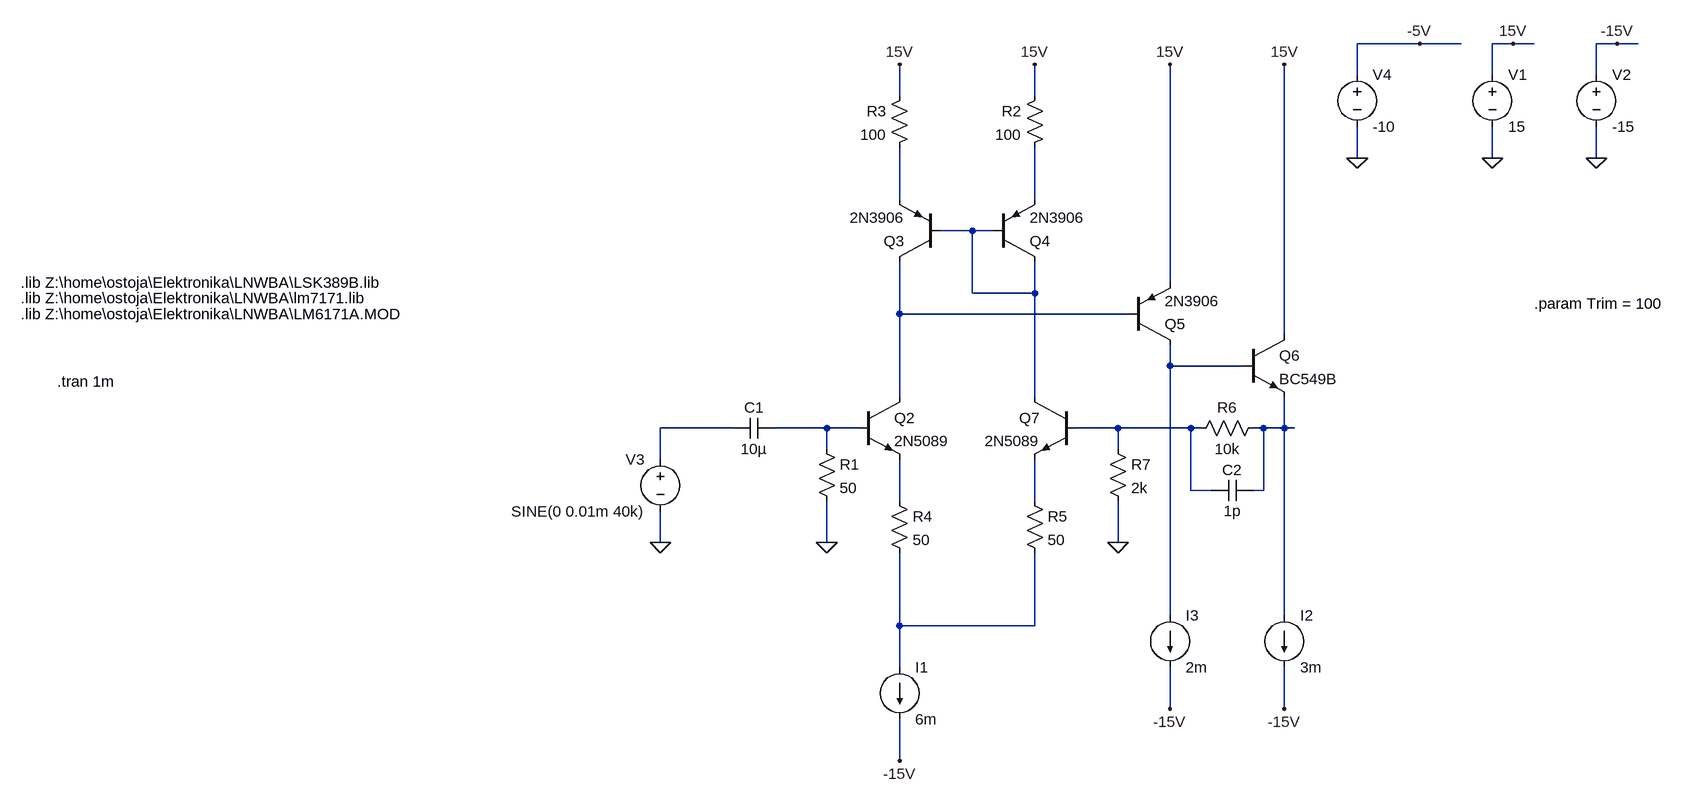
[diagram p0: schematic LNWBA_diy_opamp.asc]
LNWBA_diy_opamp.asc, the LTspice schematic file:
Version 4
SHEET 1 2516 820
WIRE 960 -592 864 -592
WIRE 1024 -592 960 -592
WIRE 1104 -592 1072 -592
WIRE 1136 -592 1104 -592
WIRE 1264 -592 1232 -592
WIRE 1296 -592 1264 -592
WIRE 864 -544 864 -592
WIRE 1072 -544 1072 -592
WIRE 1232 -544 1232 -592
WIRE 160 -512 160 -560
WIRE 368 -512 368 -560
WIRE 864 -416 864 -464
WIRE 1072 -416 1072 -464
WIRE 1232 -416 1232 -464
WIRE 160 -352 160 -432
WIRE 368 -352 368 -432
WIRE 272 -304 224 -304
WIRE 304 -304 272 -304
WIRE 576 -224 576 -560
WIRE 272 -208 272 -304
WIRE 368 -208 368 -256
WIRE 368 -208 272 -208
WIRE 160 -176 160 -256
WIRE 512 -176 160 -176
WIRE 752 -144 752 -560
WIRE 576 -96 576 -128
WIRE 688 -96 576 -96
WIRE 160 -48 160 -176
WIRE 368 -48 368 -208
WIRE -96 0 -208 0
WIRE 48 0 -32 0
WIRE 96 0 48 0
WIRE 496 0 432 0
WIRE 608 0 496 0
WIRE 624 0 608 0
WIRE 720 0 704 0
WIRE 752 0 752 -48
WIRE 752 0 720 0
WIRE 768 0 752 0
WIRE 48 32 48 0
WIRE 496 32 496 0
WIRE -208 48 -208 0
WIRE 608 96 608 0
WIRE 640 96 608 96
WIRE 720 96 720 0
WIRE 720 96 704 96
WIRE 160 112 160 48
WIRE 368 112 368 48
WIRE -208 176 -208 128
WIRE 48 176 48 112
WIRE 496 176 496 112
WIRE 576 288 576 -96
WIRE 752 288 752 0
WIRE 160 304 160 192
WIRE 368 304 368 192
WIRE 368 304 160 304
WIRE 160 368 160 304
WIRE 576 432 576 368
WIRE 752 432 752 368
WIRE 160 512 160 448
FLAG 1104 -592 15V
FLAG 1264 -592 -15V
FLAG 1232 -416 0
FLAG 1072 -416 0
FLAG 368 -560 15V
FLAG 160 512 -15V
FLAG -208 176 0
FLAG 960 -592 -5V
FLAG 864 -416 0
FLAG 48 176 0
FLAG 160 -560 15V
FLAG 576 -560 15V
FLAG 752 432 -15V
FLAG 576 432 -15V
FLAG 752 -560 15V
FLAG 496 176 0
SYMBOL voltage 1072 -560 R0
WINDOW 123 0 0 Left 0
WINDOW 39 0 0 Left 0
SYMATTR InstName V1
SYMATTR Value 15
SYMBOL voltage 1232 -560 R0
WINDOW 123 0 0 Left 0
WINDOW 39 0 0 Left 0
SYMATTR InstName V2
SYMATTR Value -15
SYMBOL voltage -208 32 M0
WINDOW 123 0 0 Left 0
WINDOW 39 0 0 Left 0
SYMATTR InstName V3
SYMATTR Value SINE(0 0.01m 40k)
SYMBOL res 384 -528 M0
SYMATTR InstName R2
SYMATTR Value 100
SYMBOL voltage 864 -560 R0
WINDOW 123 0 0 Left 0
WINDOW 39 0 0 Left 0
SYMATTR InstName V4
SYMATTR Value -10
SYMBOL cap -32 -16 R90
WINDOW 0 0 32 VBottom 2
WINDOW 3 32 32 VTop 2
SYMATTR InstName C1
SYMATTR Value 10µ
SYMBOL res 32 16 R0
SYMATTR InstName R1
SYMATTR Value 50
SYMBOL npn 96 -48 R0
SYMATTR InstName Q2
SYMATTR Value 2N5089
SYMBOL current 160 368 R0
WINDOW 123 0 0 Left 0
WINDOW 39 0 0 Left 0
SYMATTR InstName I1
SYMATTR Value 6m
SYMBOL pnp 224 -256 R180
SYMATTR InstName Q3
SYMATTR Value 2N3906
SYMBOL pnp 304 -256 M180
SYMATTR InstName Q4
SYMATTR Value 2N3906
SYMBOL pnp 512 -128 M180
SYMATTR InstName Q5
SYMATTR Value 2N3906
SYMBOL npn 688 -144 R0
SYMATTR InstName Q6
SYMATTR Value BC549B
SYMBOL current 752 288 R0
WINDOW 123 0 0 Left 0
WINDOW 39 0 0 Left 0
SYMATTR InstName I2
SYMATTR Value 3m
SYMBOL current 576 288 R0
WINDOW 123 0 0 Left 0
WINDOW 39 0 0 Left 0
SYMATTR InstName I3
SYMATTR Value 2m
SYMBOL res 176 -528 M0
SYMATTR InstName R3
SYMATTR Value 100
SYMBOL res 720 -16 R90
WINDOW 0 0 56 VBottom 2
WINDOW 3 32 56 VTop 2
SYMATTR InstName R6
SYMATTR Value 10k
SYMBOL res 480 16 R0
SYMATTR InstName R7
SYMATTR Value 2k
SYMBOL cap 704 80 R90
WINDOW 0 0 32 VBottom 2
WINDOW 3 32 32 VTop 2
SYMATTR InstName C2
SYMATTR Value 1p
SYMBOL npn 432 -48 M0
SYMATTR InstName Q7
SYMATTR Value 2N5089
SYMBOL res 144 96 R0
SYMATTR InstName R4
SYMATTR Value 50
SYMBOL res 352 96 R0
SYMATTR InstName R5
SYMATTR Value 50
TEXT -1192 -224 Left 2 !.lib Z:\\home\\ostoja\\Elektronika\\LNWBA\\LSK389B.lib
TEXT -1136 -72 Left 2 !.tran 1m
TEXT -1192 -200 Left 2 !.lib Z:\\home\\ostoja\\Elektronika\\LNWBA\\lm7171.lib
TEXT -1192 -176 Left 2 !.lib Z:\\home\\ostoja\\Elektronika\\LNWBA\\LM6171A.MOD
TEXT 1136 -192 Left 2 !.param Trim = 100

The netlist it stands for:
* LNWBA_diy_opamp.asc
V1 15V 0 15
V2 -15V 0 -15
V3 N006 0 SINE(0 0.01m 40k)
R2 15V N002 100
V4 -5V 0 -10
C1 N007 N006 10µ
R1 N007 0 50
Q2 N004 N007 N010 0 2N5089
I1 N012 -15V 6m
Q3 N004 N003 N001 0 2N3906
Q4 N003 N003 N002 0 2N3906
Q5 N005 N004 15V 0 2N3906
Q6 15V N005 N009 0 BC549B
I2 N009 -15V 3m
I3 N005 -15V 2m
R3 15V N001 100
R6 N009 N008 10k
R7 N008 0 2k
C2 N009 N008 1p
Q7 N003 N008 N011 0 2N5089
R4 N010 N012 50
R5 N011 N012 50
.model NPN NPN
.model PNP PNP
.lib standard.bjt
.lib Z:\home\ostoja\Elektronika\LNWBA\LSK389B.lib
.tran 1m
.lib Z:\home\ostoja\Elektronika\LNWBA\lm7171.lib
.lib Z:\home\ostoja\Elektronika\LNWBA\LM6171A.MOD
.param Trim = 100
.backanno
.end